# Altium schematic sheet 01-ESP32-ps2-blueretro.SchDoc
size A4; SheetNumber: 2; SheetTotal: 6
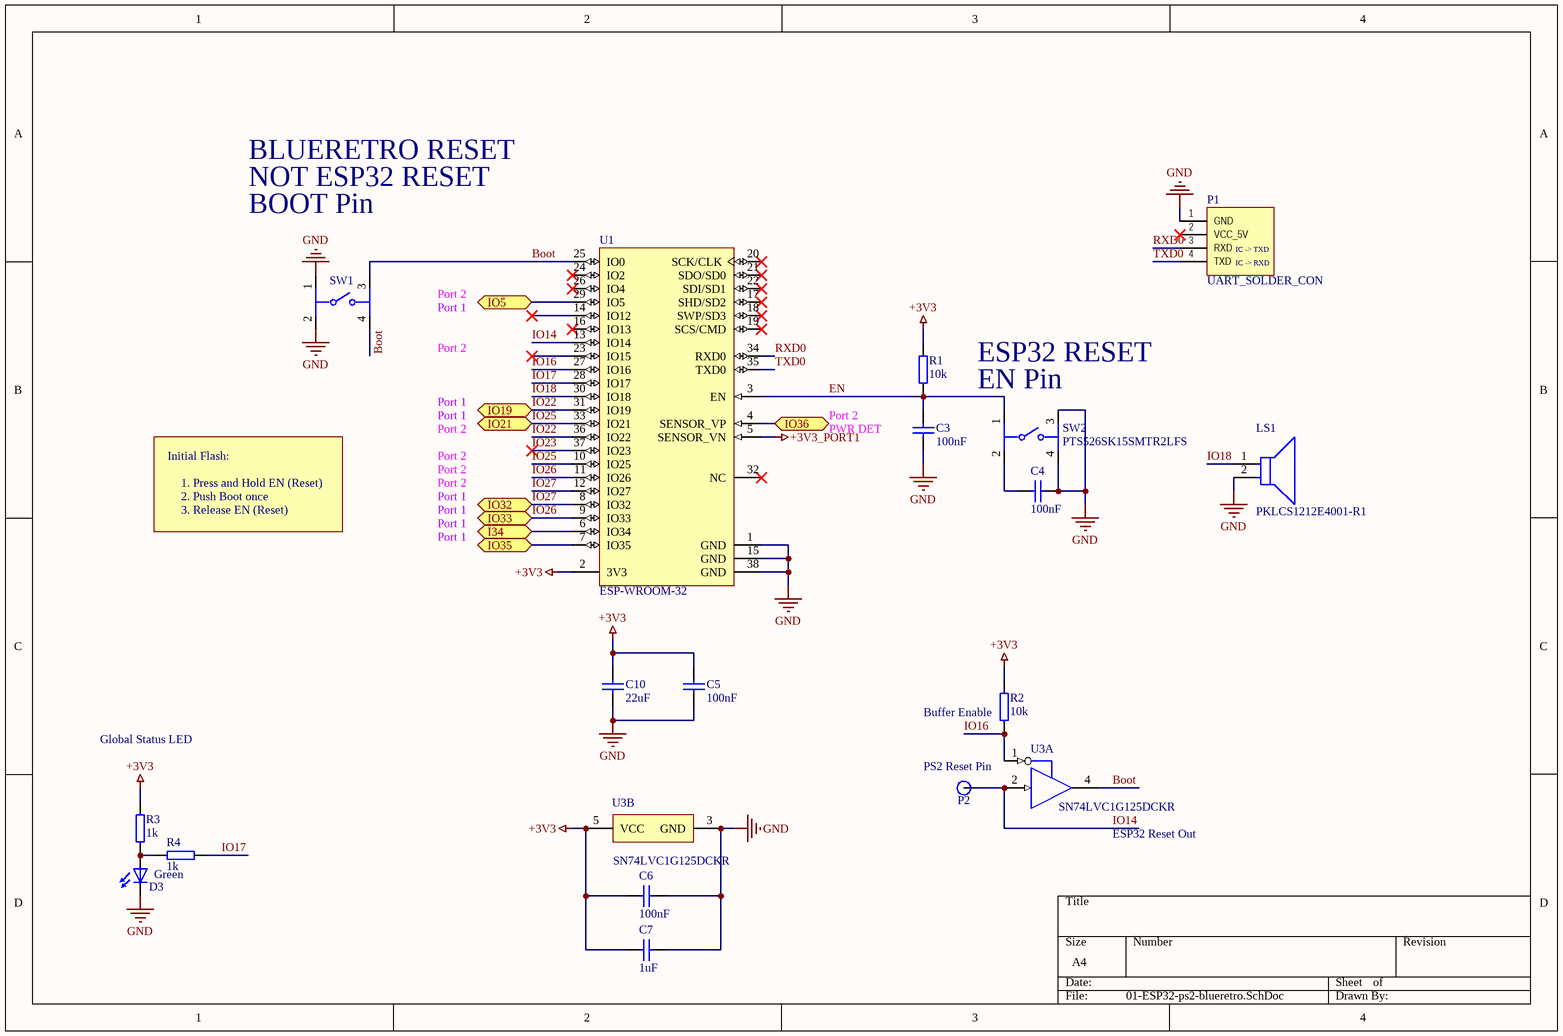
[diagram p0: 01-ESP32-ps2-blueretro.SchDoc]

## Parts
C3  value 100nF  [res_0402]  (hidden comment: cap_0402)
C4  value 100nF  [res_0402]  (hidden comment: cap_0402)
C5  value 100nF  [res_0402]  (hidden comment: cap_0402)
C6  value 100nF  [res_0402]  (hidden comment: cap_0402)
C7  value 1uF  [res_0402]  (hidden comment: cap_0402)
C10  value 22uF  [cap_0603]  (hidden comment: cap_0603)
D3  value Green  [led0603_GREEN]  (hidden comment: led_0603)
LS1  PKLCS1212E4001-R1  [FP-PKLCS1212E4001-R1-MFG]
P1  UART_SOLDER_CON  [UART_SOLDER_CON]  (no BOM)
P2  Solder_Contact_2mm  [SINGLE_SOLDER_CON]  (value not drawn)
R1  value 10k  [res_0402]  (hidden comment: res_0402)
R2  value 10k  [res_0402]  (hidden comment: res_0402)
R3  value 1k  [res_0402]  (hidden comment: res_0402)
R4  value 1k  [res_0402]  (hidden comment: res_0402)
SW1  PTS526SK15SMTR2LFS  [FP-PTS526SK15SMTR2LFS-MFG]  (value not drawn)
SW2  PTS526SK15SMTR2LFS  [FP-PTS526SK15SMTR2LFS-MFG]
U1  ESP-WROOM-32  [OLMX-ESP-WROOM-32]
U3  SN74LVC1G125DCKR  [DCK0005A_M]  (parts A,B of 2)

## Ports
I34 (bidir, see 00-ps2-blueretro[3B], 03-CTRL1-ps2-blueretro[2B]), IO5 (bidir, see 00-ps2-blueretro[3C], 04-CTRL2-ps2-blueretro[2B]), IO19 (bidir, see 00-ps2-blueretro[3B], 03-CTRL1-ps2-blueretro[2A]), IO21 (bidir, see 00-ps2-blueretro[3B], 03-CTRL1-ps2-blueretro[2B]), IO32 (bidir, see 00-ps2-blueretro[3B], 03-CTRL1-ps2-blueretro[2A]), IO33 (bidir, see 00-ps2-blueretro[3B], 03-CTRL1-ps2-blueretro[2B]), IO35 (bidir, see 00-ps2-blueretro[3B], 03-CTRL1-ps2-blueretro[2C]), IO36 (bidir, see 00-ps2-blueretro[3C], 04-CTRL2-ps2-blueretro[2C])

## Nets
+3V3: C5.2 C6.2 C7.2 C10.2 R1.2 R2.2 R3.2 U1.2(3V3) U3.5(VCC)
+3V3_PORT1: U1.5(SENSOR_VN)
GND: C3.2 C4.2 C5.1 C6.1 C7.1 C10.1 D3.2(C) LS1.2 P1.1(GND) SW1.1 SW1.2 SW2.3 SW2.4 U1.1(GND) U1.15(GND) U1.38(GND) U3.3(GND)
Boot: SW1.3 SW1.4 U1.25(IO0) U3.4(Y)
EN: C3.1 R1.1 SW2.1 U1.3(EN)
I34: U1.6(IO34) ; port I34
IO5: U1.29(IO5) ; port IO5
IO14: P2.1 U1.13(IO14) U3.2(A)
IO16: R2.1 U1.27(IO16) U3.1(~{OE})
IO17: R4.1 U1.28(IO17)
IO18: LS1.1 U1.30(IO18)
IO22: U1.31(IO19) U1.36(IO22) ; port IO19
IO23: U1.37(IO23)
IO25: U1.10(IO25) U1.33(IO21) ; port IO21
IO26: U1.9(IO33) U1.11(IO26) ; port IO33
IO27: U1.8(IO32) U1.12(IO27) ; port IO32
IO35: U1.7(IO35) ; port IO35
IO36: U1.4(SENSOR_VP) ; port IO36
RXD0: P1.3(RXD) U1.34(RXD0)
TXD0: P1.4(TXD) U1.35(TXD0)
NetC4_1: C4.1 SW2.2
NetD3_1: D3.1(A) R3.1 R4.2

Not connected (* = marked no-connect by the designer): P1 2(VCC_5V)*; U1 14(IO12)* 16(IO13)* 17(SHD/SD2)* 18(SWP/SD3)* 19(SCS/CMD)* 20(SCK/CLK)* 21(SDO/SD0)* 22(SDI/SD1)* 23(IO15)* 24(IO2)* 26(IO4)* 32(NC)*

## Notes on the sheet
- BLUERETRO RESET
- BOOT Pin
- NOT ESP32 RESET
- Port 1
- Port 2
- ESP32 RESET
- PWR DET
- EN Pin
- Initial Flash:
- 1. Press and Hold EN (Reset)
- 2. Push Boot once
- 3. Release EN (Reset)
- (near R2) Buffer Enable
- Global Status LED
- (near P2) PS2 Reset Pin
- ESP32 Reset Out
- (in symbol UART_SOLDER_CON) IC -> TXD; IC -> RXD

## Library data of the parts
D3 = led_0603: Green 3,2V 20mA; Manufacturer: Würth Elektronik; Manufacturer Part Number: 150060GS75000; Supplier: Digikey; Price: 0,14; Supplier Part Number: 732-4971-1-ND; ComponentLink1Description: Supplier Link; ComponentLink1URL: https://www.digikey.at/de/products/detail/w%C3%BCrth-elektronik/150060GS75000/4489898; ComponentLink2Description: Manufacturer Link; ComponentLink2URL: *; ComponentLink3Description: Datasheet Link; ComponentLink3URL: https://www.we-online.com/components/products/datasheet/150060GS75000.pdf
LS1 = CMP-2000-05277-2: AUDIO PIEZO TRANSDUCER 25V SMD; Self Resonant Frequency: 4kHz; Nominal Input Voltage: 3V; Washable: No; Diameter: 12mm; Min Operating Temperature: -20°C; Lead Free: Lead Free; Voltage Rating: 25V; Radiation Hardening: No; Max Supply Voltage: 25V; Package Quantity: 1; Max Frequency: 4kHz; Width: 12mm; Voltage Rating (DC): 25V; Packaging: Tape and Reel; Max Operating Temperature: 70°C; Frequency: 4kHz; Length: 12mm; Height: 3mm; Termination: Solder; REACH SVHC: No SVHC; Depth: 12mm; Mount: Surface Mount
SW1 SW2 = CMP-10040-000013-1: TACT 5.2 X 5.2, 1.5 MM H, 260GF,; Manufacturer: C&K; Operating Force: 250gf; Throw Configuration: SPST-NO; Contact Current Rating: 50mA; Standoff Height: 0mm; Contact Resistance: 100mΩ; Voltage Rating Dc: 12V; Electromechanical Life: 200000Cycles; Device Class L3: Tactile Switches; Device Class L2: Switches; Temperature: -20°C to +70°C; Temperature Range Low: -20°C; Package: PTS526SK15SMTR2LFS; Temperature Range High: +70°C; ComponentLink2Description: Datasheet; Device Class L1: Electromechanical; Height: 1.65mm; Digikey Description: TACT 5.2 X 5.2, 1.5 MM H, 260GF,; Category: Switch; RoHS: TRUE; Automotive: No; Lead Free: Yes; Manufacturer Part Number: PTS526SK15SMTR2LFS; Octopart: https://octopart.com/pts526+sk15+smtr2+lfs-c%26k+components-100617999; ComponentLink2URL: https://www.ckswitches.com/media/2780/pts526.pdf
U1 = CMP-2000-07454-1: Espressif System, 2.7 to 3.6 V, -40 to 85 degC, 38-Pin SMD; Manufacturer: Olimex; Package Description: 38-Pin Surface Mount Device, Body 18 x 25.5 mm, Pitch 1.27 mm; Manufacturer URL: https://www.olimex.com; RoHSCompliant: false; Mounting Technology: SurfaceMount; Datasheet Version: Rev. 2.1, 09/2017; Datasheet URL: http://www.espressif.com/sites/default/files/documentation/esp-wroom-32_datasheet_en.pdf; Package Reference: ESP-WROOM-32
U3 = CMP-0859-00281-3: Single Bus Buffer Gate With 3-State Outputs, DCK0005A, LARGE T&R; Manufacturer: Texas Instruments; Bits(#): 1; tpd @ Nom Voltage(Max)(ns): 9,5.5,4.5,4; 3-State Output: Yes; Output Type: CMOS; Sub-Family: Non-Inverting Buffer/Driver; Logic: True; Output Drive (IOL/IOH)(Max)(mA): 32/-32; Voltage(Nom)(V): 1.8,2.5,3.3,5; ICC @ Nom Voltage(Max)(mA): 0.01; Technology Family: LVC; VCC(Min)(V): 1.65; VCC(Max)(V): 5.5; F @ Nom Voltage(Max)(Mhz): 150; Rating: Catalog; Input Type: CMOS/TTL; Schmitt Trigger: No; PackageReference: DCK0005A; Generic Part Number: SN74LVC1G125; DatasheetVersion: SCES223T; Operating Temperature Range(C): -40 to 125,-40 to 85